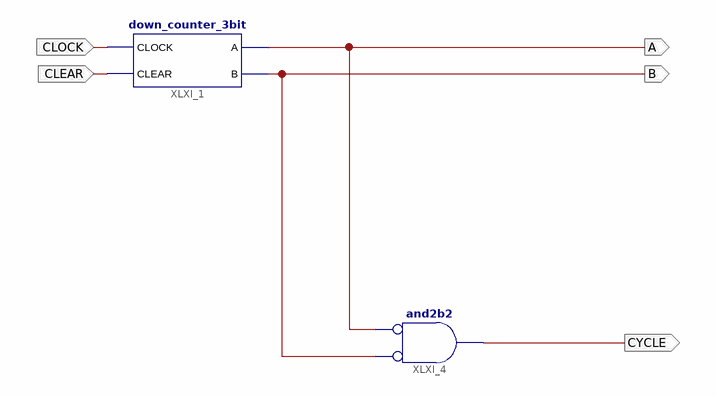
[diagram p0: schematic sheet 1]
// Xilinx ISE schematic Decimal.sch (spartan3) as structural Verilog: 2 symbols, 5 ports
module Decimal (
  input  CLOCK,
  input  CLEAR,
  output CYCLE,
  output B,
  output A
);

  down_counter_3bit XLXI_1 (.CLOCK(CLOCK), .CLEAR(CLEAR), .A(A), .B(B));
  and XLXI_4 (CYCLE, ~B, ~A);  // and2b2
endmodule
